# EAGLE design Simple Heart v2 - grounded (EAGLE 7.3.0)
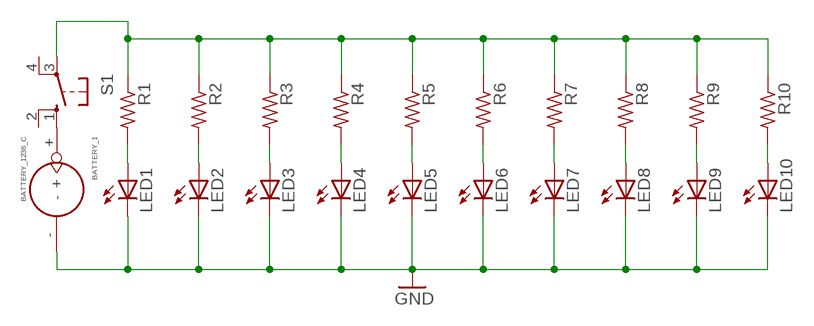
[diagram p0: schematic, sheet 1]

## Parts
BATTERY_1  BATTERY_1236_C  [BATTERY_1236_C]
LED1  LED5MM  [LED5MM]
LED2  LED5MM  [LED5MM]
LED3  LED5MM  [LED5MM]
LED4  LED5MM  [LED5MM]
LED5  LED5MM  [LED5MM]
LED6  LED5MM  [LED5MM]
LED7  LED5MM  [LED5MM]
LED8  LED5MM  [LED5MM]
LED9  LED5MM  [LED5MM]
LED10  LED5MM  [LED5MM]
R1  R-US_0204/7  [0204/7]
R2  R-US_0204/7  [0204/7]
R3  R-US_0204/7  [0204/7]
R4  R-US_0204/7  [0204/7]
R5  R-US_0204/7  [0204/7]
R6  R-US_0204/7  [0204/7]
R7  R-US_0204/7  [0204/7]
R8  R-US_0204/7  [0204/7]
R9  R-US_0204/7  [0204/7]
R10  R-US_0204/7  [0204/7]
S1  10-XX  [B3F-10XX]

## Nets
GND: BATTERY_1.- LED1.K(C) LED2.K(C) LED3.K(C) LED4.K(C) LED5.K(C) LED6.K(C) LED7.K(C) LED8.K(C) LED9.K(C) LED10.K(C)
N$1: LED1.A R1.2
N$2: LED2.A R2.2
N$3: LED3.A R3.2
N$4: LED4.A R4.2
N$5: LED5.A R5.2
N$6: LED6.A R6.2
N$7: LED7.A R7.2
N$8: LED8.A R8.2
N$9: LED9.A R9.2
N$10: LED10.A R10.2
N$11: BATTERY_1.+ S1.1(S)
N$12: R1.1 R2.1 R3.1 R4.1 R5.1 R6.1 R7.1 R8.1 R9.1 R10.1 S1.3(P)
Unconnected: S1.2(S1) S1.4(P1)

## Library data of the parts
BATTERY_1 = Itead_BP_110825:BATTERY_1236_C: SOC004
LED1-LED10 = led:LED: LED OSRAM: - CHIPLED LG R971, LG N971, LY N971, LG Q971, LY Q971, LO R971, LY R971 LH N974, LH R974 LS Q976, LO Q976, LY Q976 LO Q996 - Hyper CHIPLED LW Q18S LB Q993, LB Q99A, LB R99A - SideLED LS A670, LO A670, LY A670, LG A670, LP A670 LB A673, LV A673, LT A673, LW A673 LH A674 LY A675 LS A676, LA A676, LO A676, LY A676, LW A676 LS A679, LY A679, LG A679 - Hyper Micro SIDELED® LS Y876, LA Y876, LO Y876, LY Y876 LT Y87S - SmartLED LW L88C, LW L88S LB L89C, LB L89S, LG L890 LS L89K, LO L89K, LY L89K LS L896, LA L896, LO L896, LY L896 - TOPLED LS T670, LO T670, LY T670, LG T670, LP T670 LSG T670, LSP T670, LSY T670, LOP T670, LYG T670 LG T671, LOG T671, LSG T671 LB T673, LV T673, LT T673, LW T673 LH T674 LS T676, LA T676, LO T676, LY T676, LB T676, LH T676, LSB T676, LW T676 LB T67C, LV T67C, LT T67C, LS T67K, LO T67K, LY T67K, LW E67C LS E67B, LA E67B, LO E67B, LY E67B, LB E67C, LV E67C, LT E67C LW T67C LS T679, LY T679, LG T679 LS T770, LO T770, LY T770, LG T770, LP T770 LB T773, LV T773, LT T773, LW T773 LH T774 LS E675, LA E675, LY E675, LS T675 LS T776, LA T776, LO T776, LY T776, LB T776 LHGB T686 LT T68C, LB T68C - Hyper Mini TOPLED® LB M676 - Mini TOPLED Santana® LG M470 LS M47K, LO M47K, LY M47K Source: http://www.osram.convergy.de LUXEON: - LUMILED® LXK2-PW12-R00, LXK2-PW12-S00, LXK2-PW14-U00, LXK2-PW14-V00 LXK2-PM12-R00, LXK2-PM12-S00, LXK2-PM14-U00 LXK2-PE12-Q00, LXK2-PE12-R00, LXK2-PE12-S00, LXK2-PE14-T00, LXK2-PE14-U00 LXK2-PB12-K00, LXK2-PB12-L00, LXK2-PB12-M00, LXK2-PB14-N00, LXK2-PB14-P00, LXK2-PB14-Q00 LXK2-PR12-L00, LXK2-PR12-M00, LXK2-PR14-Q00, LXK2-PR14-R00 LXK2-PD12-Q00, LXK2-PD12-R00, LXK2-PD12-S00 LXK2-PH12-R00, LXK2-PH12-S00 LXK2-PL12-P00, LXK2-PL12-Q00, LXK2-PL12-R00 Source: www.luxeon.com KINGBRIGHT: KA-3528ASYC Source: www.kingbright.com
R1-R10 = resistor:R-US_: RESISTOR, American symbol
S1 = switch-omron:10-XX: OMRON SWITCH; MPN: B3F-1000; OC_FARNELL: 176432; OC_NEWARK: 36M3542

## Board
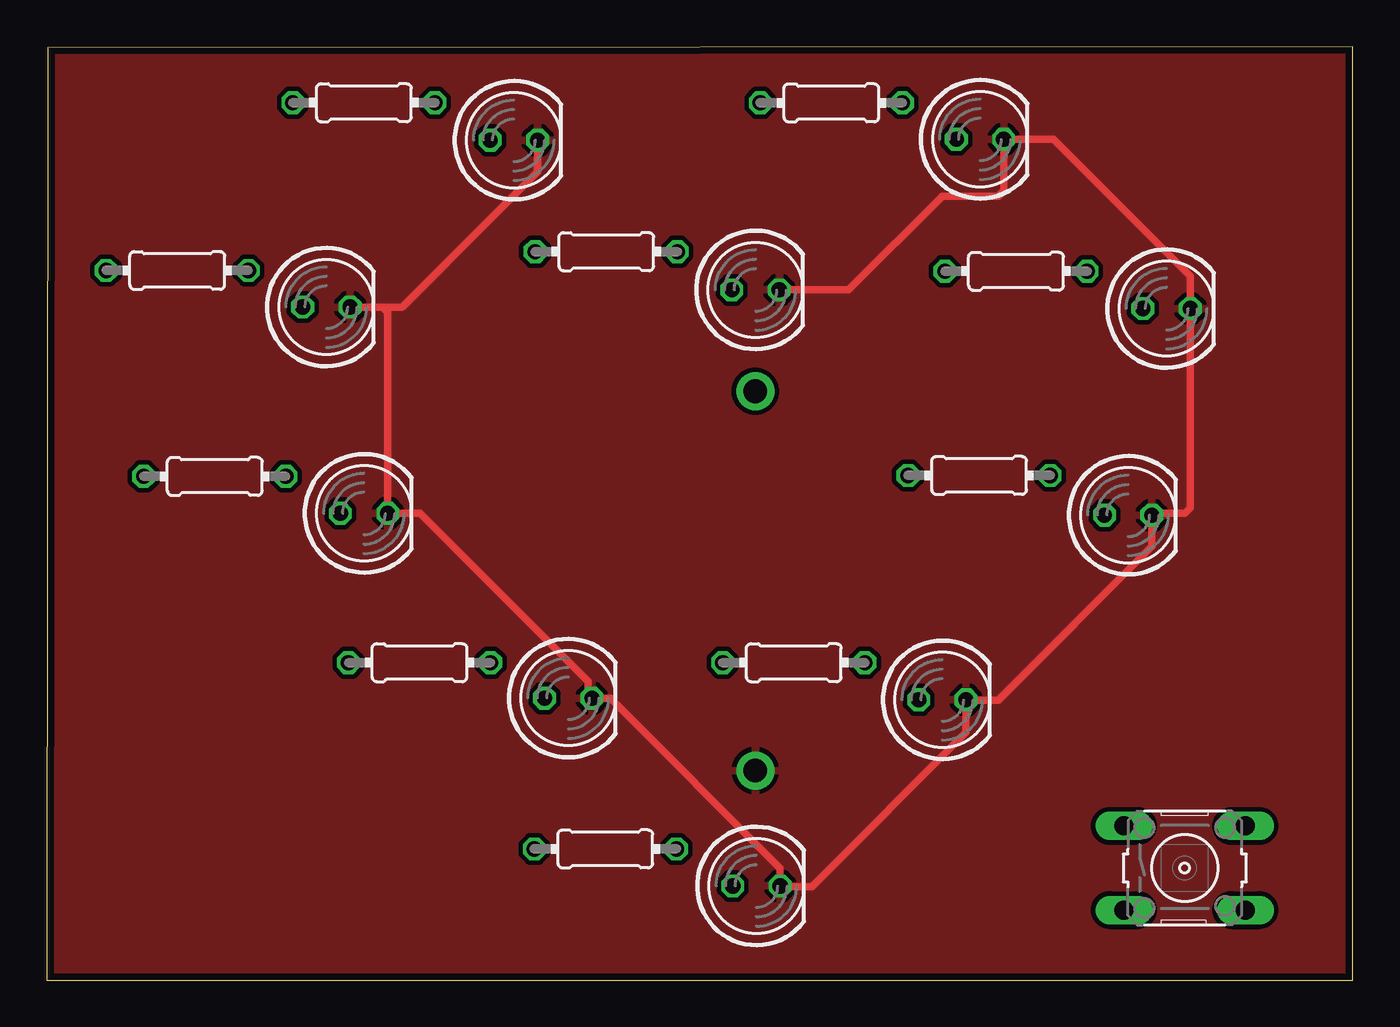
[diagram p1: board, top side]
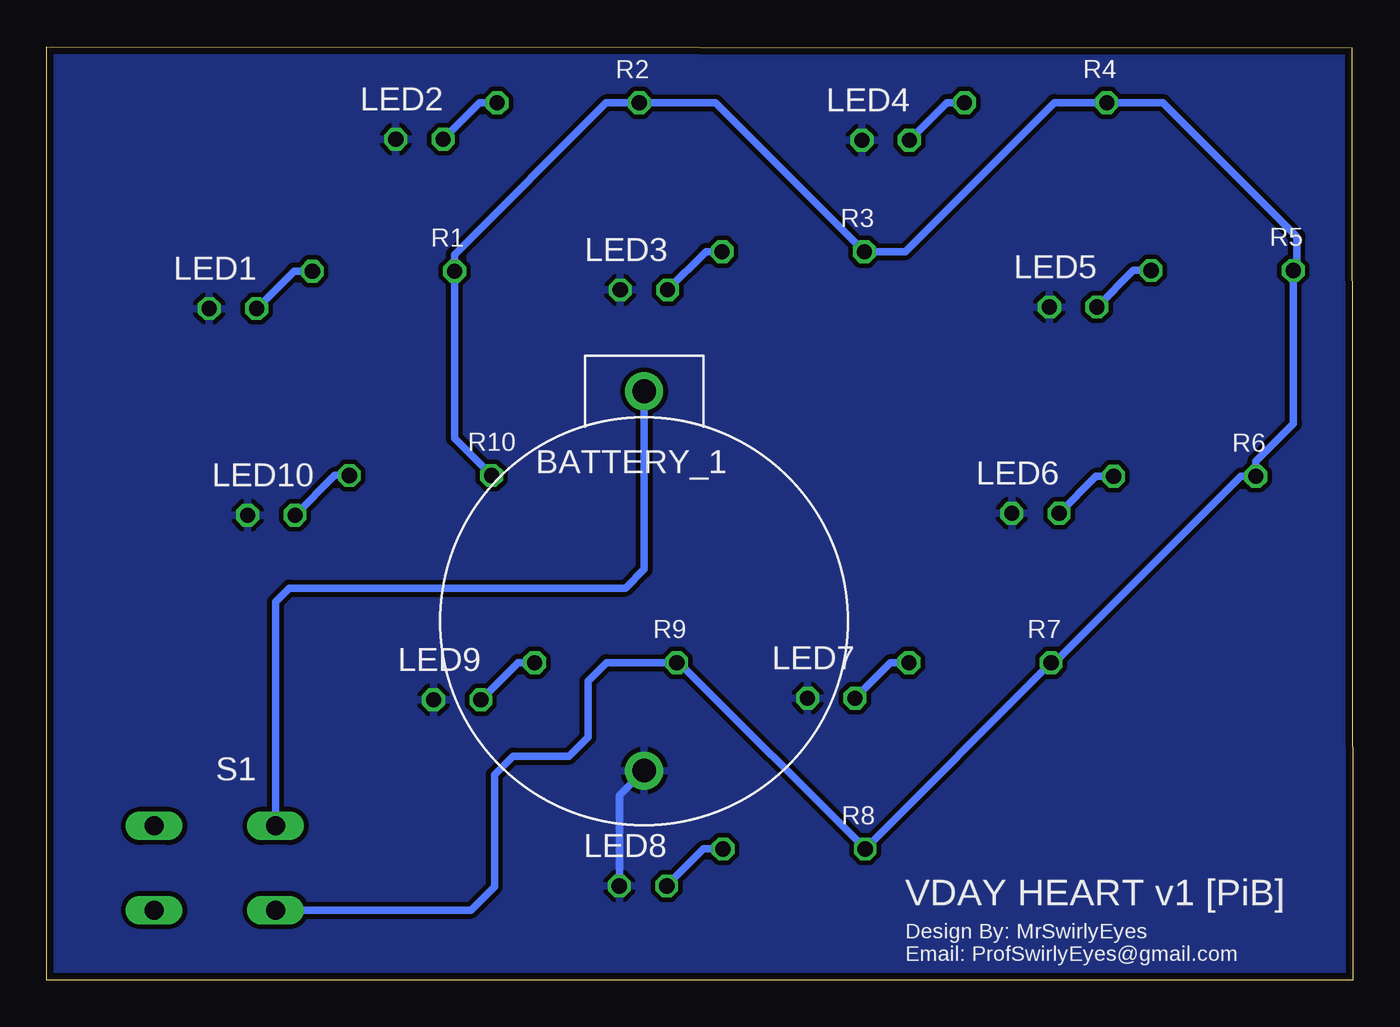
[diagram p2: board, bottom side, seen from below]

Size 70 x 50 mm. Coordinates in mm from the lower left corner, seen from the top.
Outline: 0,0 70,0 70,50 0.05,49.93 0,0
Copper layers (1*16): Top 0.0356mm / dielectric 1.5011mm / Bottom 0.0356mm
Design rules "LaenPCBOrder": minimum track width 6mil, minimum drill 13mil, track to track 6mil, track to pad 6mil, pad to pad 6mil, via to via 6mil, smd to smd 6mil, copper to edge 15mil, drill to drill 6mil, minimum pad ring 7mil, minimum via ring 7mil, stop-mask expansion 3mil, vias tented up to drill 0mil, thermal gap 10mil

### Footprints (pad centres in the part's own frame; a part is rotated, then mirrored left to right if it is on the bottom)
BATTERY_1236_C = drill 1.27 pad 2.032: + 0,0; - 0,20.32
LED5MM = drill 0.813 octagon: A -1.27,0; K 1.27,0
0204/7 = drill 0.813 octagon: 1 -3.81,0; 2 3.81,0
B3F-10XX = drill 1.016 long: 1 -3.251,2.261; 2 3.251,2.261; 3 -3.251,-2.261; 4 3.251,-2.261

### Placement (x,y rotation side)
BATTERY_1  37.98,31.54 180 bottom
LED1  60.02,35.97 0 top
LED2  50.02,45.04 0 top
LED3  37.99,36.97 0 top
LED4  25.04,44.99 0 top
LED5  14.99,36.05 0 top
LED6  17.01,25 0 top
LED7  27.95,15.1 0 top
LED8  38.04,5.04 0 top
LED9  48,15.01 0 top
LED10  57.96,24.9 0 top
R1  51.95,37.97 0 top
R2  42.05,46.99 0 top
R3  29.99,39.02 0 top
R4  17,47 0 top
R5  7,38.01 0 top
R6  9.01,26.98 0 top
R7  19.98,17 0 top
R8  29.94,7.02 0 top
R9  40.04,17 0 top
R10  49.97,27.03 0 top
S1  60.99,6 0 top

### Tracks (layer width: path | path; a pad name or v marks a point on that pad's centre or on a via)
GND
  Top 0.406: LED3.K 42.97,36.97 48,42 51,42 51.29,42.29 LED2.K 53.96,45.04 61.29,37.71 LED1.K 61.29,25.29 61,25 59.33,25 LED10.K 59.23,23.23 51,15 LED9.K 49.27,13.27 41,5 39.35,5 LED8.K 39.31,6 30.21,15.1 LED7.K 29,15.32 29,16 20,25 LED6.K 18.28,35.77 18,36.05 | LED5.K 18,36.05 | 18,36.05 19.05,36.05 26.31,43.31 LED4.K
  Bottom 0.406: LED8.K 39.31,9.89 BATTERY_1.-
  pour Bottom (isolate 0.254): 0,50 70,50 70,0 0,0
  pour Top (isolate 0.254): 0,50 70,50 70,0 0,0
N$1
  Bottom 0.406: R1.2 56.75,37.97 LED1.A
N$2
  Bottom 0.406: R2.2 46.8,46.99 LED2.A
N$3
  Bottom 0.406: R3.2 34.67,39.02 LED3.A
N$4
  Bottom 0.406: R4.2 21.76,47 LED4.A
N$5
  Bottom 0.406: R5.2 11.76,38.01 LED5.A
N$6
  Bottom 0.406: R6.2 13.76,26.98 LED6.A
N$7
  Bottom 0.406: R7.2 24.78,17 LED7.A
N$8
  Bottom 0.406: R8.2 34.79,7.02 LED8.A
N$9
  Bottom 0.406: R9.2 44.74,17 LED9.A
N$10
  Bottom 0.406: R10.2 54.56,27.03 LED10.A
N$11
  Bottom 0.406: S1.1 57.74,20.26 57,21 38.98,21 37.98,22 BATTERY_1.+
N$12
  Bottom 0.406: R10.1 48.14,29.01 R1.1 48.14,38.86 40.01,46.99 R2.1 34.15,46.99 R3.1 23.98,39.02 16,47 R4.1 10.18,47 3,39.82 3,38.2 R5.1 3.19,29.81 5.2,27.8 R6.1 5.22,27 6,27 16,17 R7.1 26.13,7.04 R8.1 36.11,17 R9.1 40,17 41,16 41,13 42,12 45,12 46,11 46,5 47.26,3.74 S1.3

### Text on the board
bPlace: VDAY HEART v1 [PiB] | Design By: MrSwirlyEyes / Email: ProfSwirlyEyes@gmail.com